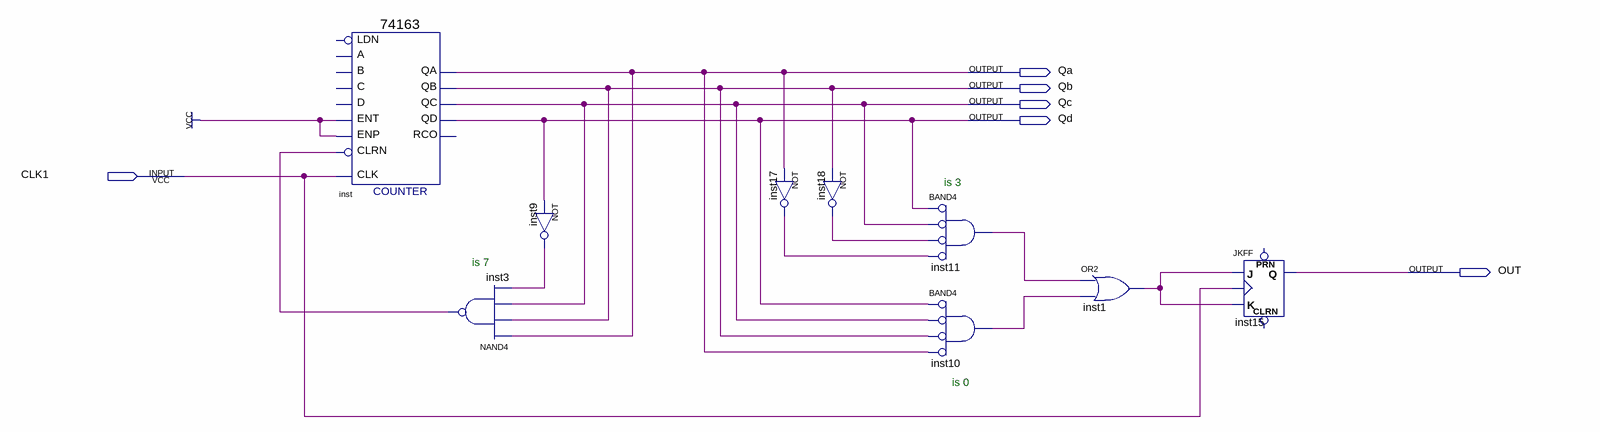
[diagram p0: schematic sheet]
// Quartus schematic task1.bdf as structural Verilog: 9 symbols, 6 pins
module task1 (
  input  CLK1,
  output Qa,
  output Qb,
  output Qc,
  output Qd,
  output OUT
);

  wire inst1_out, inst3_out, inst9_out, inst10_out, inst11_out, inst17_out, inst18_out;

  \74163  inst (
    .ENT(1'b1), .CLRN(inst3_out), .CLK(CLK1), .ENP(1'b1), .QA(Qa), .QB(Qb), .QC(Qc), .QD(Qd));  // open: C, B, A, D, LDN, RCO
  nand inst3 (inst3_out, Qa, Qb, Qc, inst9_out);
  not inst9 (inst9_out, Qd);
  not inst17 (inst17_out, Qa);
  not inst18 (inst18_out, Qb);
  and inst11 (inst11_out, ~Qd, ~Qc, ~inst18_out, ~inst17_out);  // BAND4
  and inst10 (inst10_out, ~Qd, ~Qc, ~Qb, ~Qa);  // BAND4
  or inst1 (inst1_out, inst11_out, inst10_out);
  JKFF inst15 (.K(inst1_out), .J(inst1_out), .CLK(CLK1), .Q(OUT));  // open: PRN, CLRN

  // Notes on the sheet:
  //   is 3
  //   is 7
  //   is 0
endmodule
